# Altium schematic sheet attenuator.SchDoc
size 300 x 200 mm; SheetNumber: 1; SheetTotal: 1
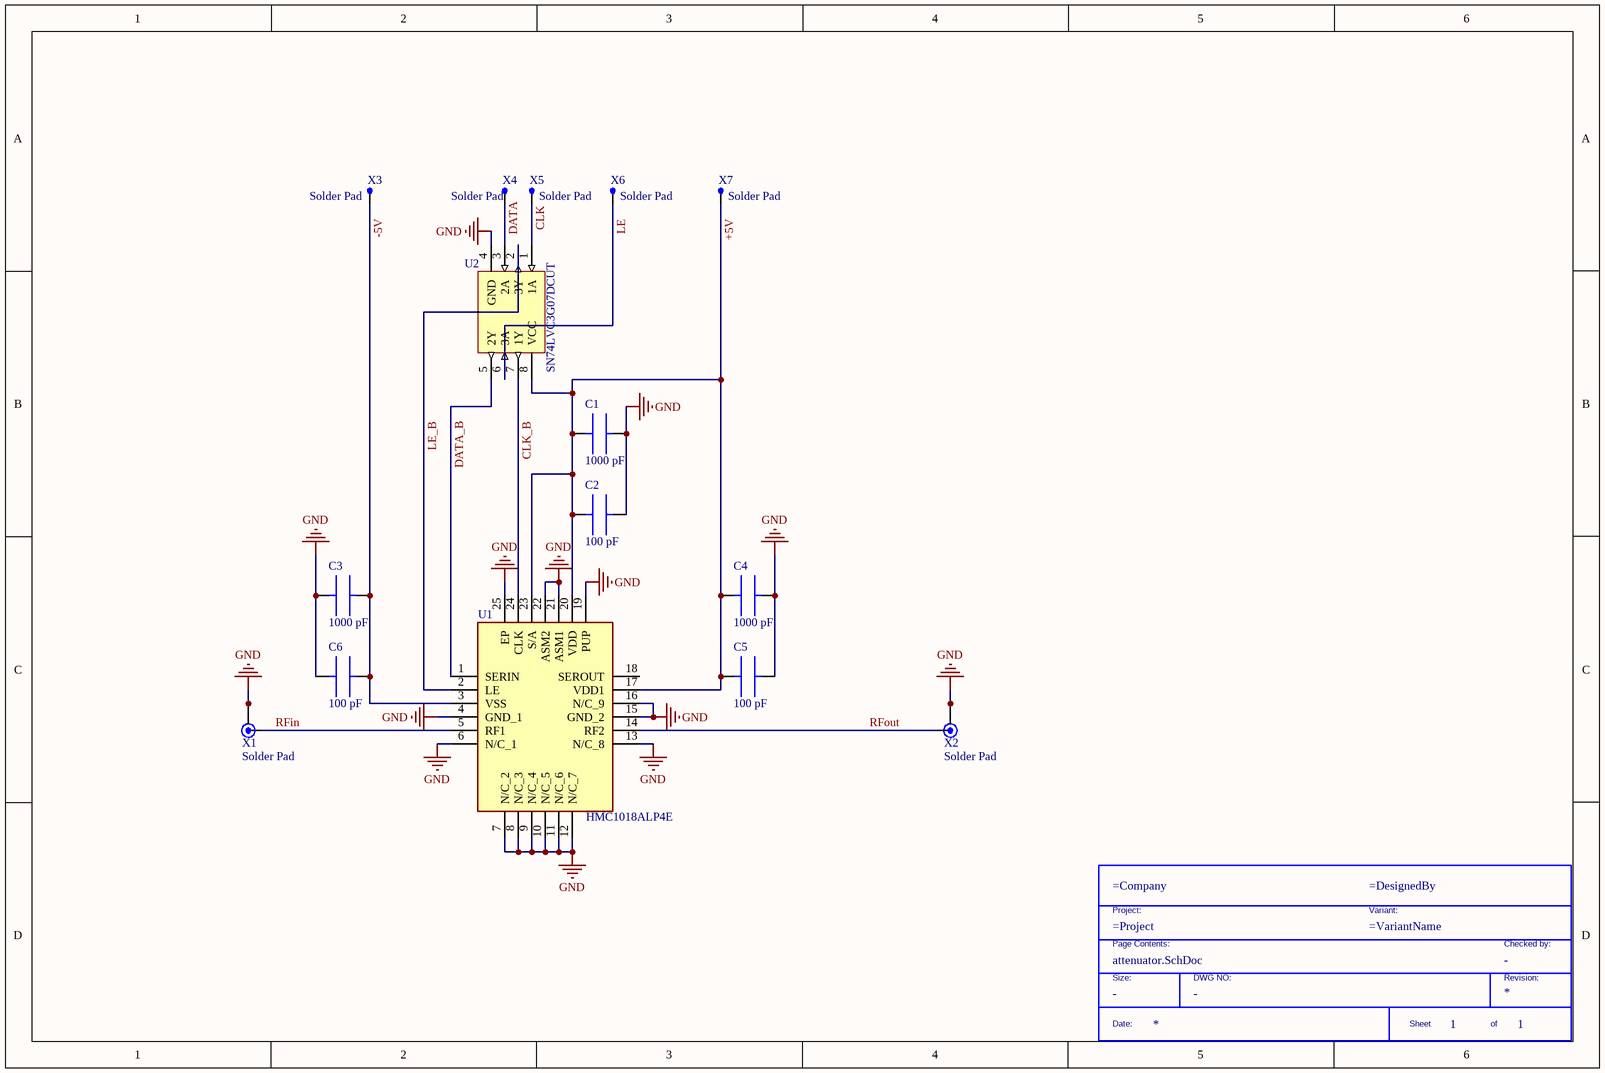
[diagram p0: attenuator.SchDoc]

## Parts
*  TitleBlock  (value not drawn)  (graphical)
C1  1000 pF  [C1000pF__C100nF]
C2  100 pF  [C100pF]
C3  1000 pF  [C1000pF__C100nF]
C4  1000 pF  [C1000pF__C100nF]
C5  100 pF  [C100pF]
C6  100 pF  [C100pF]
U1  HMC1018ALP4E  [Att_HMC101018ALPE]
U2  SN74LVC3G07DCUT  [Buf_SN74LVC3G07DCUT]
X1  Solder Pad  [CPW Edge Connector]
X2  Solder Pad  [CPW Edge Connector]
X3  Solder Pad  [Solder Pad]
X4  Solder Pad  [Solder Pad]
X5  Solder Pad  [Solder Pad]
X6  Solder Pad  [Solder Pad]
X7  Solder Pad  [Solder Pad]

## Nets
GND: C1.2 C2.2 C3.1 C4.2 C5.2 C6.1 U1.4(GND_1) U1.6(N/C_1) U1.7(N/C_2) U1.8(N/C_3) U1.9(N/C_4) U1.10(N/C_5) U1.11(N/C_6) U1.12(N/C_7) U1.13(N/C_8) U1.15(GND_2) U1.16(N/C_9) U1.19(PUP) U1.21(ASM1) U1.22(ASM2) U1.25(EP) U2.4(GND) X1.2 X1.3 X2.2 X2.3
+5V: C1.1 C2.1 C4.1 C5.1 U1.17(VDD1) U1.20(VDD) U1.23(S/A) U2.8(VCC) X7.1
-5V: C3.2 C6.2 U1.3(VSS) X3.1
CLK: U2.1(1A) X5.1
CLK_B: U1.24(CLK) U2.7(1Y)
DATA: U2.3(2A) X4.1
DATA_B: U1.1(SERIN) U2.5(2Y)
LE: U2.6(3A) X6.1
LE_B: U1.2(LE) U2.2(3Y)
RFin: U1.5(RF1) X1.1
RFout: U1.14(RF2) X2.1

Not connected (* = marked no-connect by the designer): U1 18(SEROUT)

## Notes on the sheet
- (in symbol TitleBlock) Project:; Variant:; Page Contents:; Checked by:; Size:; DWG NO:; Revision:; Date:; Sheet; of

## Library data of the parts
* = TitleBlock: Standard Title Block; DWG NO: -; Size: -; Checked by: -
C1 C3 C4 = C1000pF_GCM1885C1H102FA16D: Ceramic Capacitor, Multilayer, Ceramic, 50V, 1% +Tol, 1% -Tol, C0G, 30ppm/Cel TC, 0.001uF, Surface Mount, 0603; Manufacturer: Murata; Value: 1nF; Multilayer: Yes; Reference Standard: AEC-Q200; Supplier: Mouser; Supplier Part Number: 81-GCM1885C1H102FA6D; Manufacturer Part Number: GCM1885C1H102FA16D; RoHS: Yes; Category: Ceramic Capacitors; Stock: 27229; Pricing: 1=0.35, 10=0.229, 50=0.229, 100=0.138, 1000=0.092, 10000=0.074 (USD); Mounting Technology: Surface Mount; Pins: 2; Dielectric Material: Ceramic; Package Shape: Rectangular; Case/Package: 0603; Min Operating Temperature: -55°C; Max Operating Temperature: 125°C; Capacitor Type: Ceramic; Tolerance  (fill in as +-): 1%; Packaging: Tape and Reel; Tolerance (fill in as +-): 1%; Rated DC Voltage (URdc): 50V; Temperature Characteristics Code: C0G; Termination: Wraparound; Reach SVHC Compliant: Yes; RoHS Compliant: Yes; ComponentLink1URL: https://datasheet.ciiva.com:443/pdfs/VipMasterIC/IC/MURE/MURE-S-A0004370842/MURE-S-A0004372260-1.pdf?src-supplier=IHS+Markit; ComponentLink1Description: https://datasheet.ciiva.com:443/pdfs/VipMasterIC/IC/MURE/MURE-S-A0004370842/MURE-S-A0004372260-1.pdf?src-supplier=IHS+Markit
C2 C5 C6 = C100pF_GRM1555C2A101FA01D: Multilayer Ceramic Capacitors MLCC - SMD/SMT 100 pF 100 VDC 1% 0402 C0G (NP0); Manufacturer: Murata; Supplier: Mouser; Supplier Part Number: 81-GRM1555C2A11FA1D; Manufacturer Part Number: GRM1555C2A101FA01D; RoHS: No; Stock: 21646; Pricing: 1=0.18, 10=0.119, 50=0.119, 100=0.06, 1000=0.039, 10000=0.035 (USD)
U1 = Att_HMC1018ALP4E: Attenuators Attenuators; Manufacturer_Name: Analog Devices; Geometry.Height: 1mm; Mouser Part Number: 584-HMC1018ALP4E; Mouser Price/Stock: https://www.mouser.co.uk/ProductDetail/Analog-Devices/HMC1018ALP4E?qs=XflvcvBPbgW0VxFFfcxVBA%3D%3D; Manufacturer_Part_Number: HMC1018ALP4E; Datasheet Link: https://www.analog.com/media/en/technical-documentation/data-sheets/hmc1018a.pdf
U2 = Buf_SN74LVC3G07DCUT: Buffer, LVC/LCX/Z Series, 3-Func, 1-Input, CMOS, PDSO8; Manufacturer: Texas Instruments; Package Body Material: Plastic; Load Capacitance (CL): 50pF; Load/Preset Input: Yes; Max I(ol): 24mA; Channels: 3; Number of Inputs: 1; Output Characteristics: OPEN-DRAIN; Power Supplies: 3.3V; Prop. Delay@Nom-Sup: 3.7ns; Propagation Delay (tpd): 7.8ns; Schmitt Trigger: No; Max Supply Voltage: 5.5V; Min Supply Voltage: 1.65V; Nominal Supply Voltage: 1.8V; Qualification Status: Not Qualified; Supplier: Mouser; Supplier Part Number: 595-SN74LVC3G07DCUT; Manufacturer Part Number: SN74LVC3G07DCUT; RoHS: Yes; Category: Buffers, Drivers and Transceivers; Stock: 5143; Pricing: 1=1.13, 10=0.738, 50=0.738, 100=0.584, 1000=0.486, 10000=0.482 (USD); Case/Package: VSSOP; Pins: 8; Package Shape: Rectangular; Terminal Finish: Nickel; Min Operating Temperature: -40°C; Max Operating Temperature: 125°C; JESD-609 Code: e4; JESD-30 Code: R-PDSO-G8; Logic Type: BUFFER; Moisture Sensitivity Level: 1; Package Style: SMALL OUTLINE, VERY THIN PROFILE, SHRINK PITCHMeter; Packaging: Tape and Reel; Peak Reflow Temperature (Cel): 260°C; Surface Mount: Yes; Technology: CMOS; Terminal Form: Gull Wing; Terminal Position: DUAL; Length: 2.3mm; Width: 2mm; Height - Seated (Max): 0.9mm; Terminal Pitch: 0.5mm; Temperature Grade: AUTOMOTIVE; RoHS Compliant: Yes; Reach SVHC Compliant: Yes; ComponentLink1URL: https://www.ti.com:443/lit/ds/symlink/sn74lvc3g07.pdf?src-supplier=IHS+Markit; ComponentLink1Description: https://www.ti.com:443/lit/ds/symlink/sn74lvc3g07.pdf?src-supplier=IHS+Markit; ComponentLink2URL: https://datasheet.ciiva.com/22704/1831202-22704940.pdf?src-supplier=Element14; ComponentLink2Description: https://datasheet.ciiva.com/22704/1831202-22704940.pdf?src-supplier=Element14; ComponentLink3URL: https://datasheet.ciiva.com/15094/getdatasheetpartid-42252-15094217.pdf?src-supplier=Verical; ComponentLink3Description: https://datasheet.ciiva.com/15094/getdatasheetpartid-42252-15094217.pdf?src-supplier=Verical; ComponentLink4URL: https://datasheet.ciiva.com/41455/001017196-da-01-en-ic-b-dvr-trp-sn74lvc3g07dcut-vssop-8-tid-41455972.pdf?src-supplier=Conrad; ComponentLink4Description: https://datasheet.ciiva.com/41455/001017196-da-01-en-ic-b-dvr-trp-sn74lvc3g07dcut-vssop-8-tid-41455972.pdf?src-supplier=Conrad; ComponentLink5URL: https://datasheet.ciiva.com/7744/sn74lvc3g07-7744042.pdf?src-supplier=Element14; ComponentLink5Description: https://datasheet.ciiva.com/7744/sn74lvc3g07-7744042.pdf?src-supplier=Element14; ComponentLink6URL: https://datasheet.ciiva.com/6622/sn74lvc3g07-6622474.pdf?src-supplier=Digikey; ComponentLink6Description: https://datasheet.ciiva.com/6622/sn74lvc3g07-6622474.pdf?src-supplier=Digikey; ComponentLink7URL: https://datasheet.ciiva.com/6622/sn74lvc3g07-6622477.pdf?src-supplier=Digikey; ComponentLink7Description: https://datasheet.ciiva.com/6622/sn74lvc3g07-6622477.pdf?src-supplier=Digikey; ComponentLink8URL: https://datasheet.ciiva.com/6622/sn74lvc3g07-6622478.pdf?src-supplier=Digikey; ComponentLink8Description: https://datasheet.ciiva.com/6622/sn74lvc3g07-6622478.pdf?src-supplier=Digikey
X1 X2 = RF  CPW Solder Pad: Solder pad for RF Coplanar Waveguide Rogers 4350B Thickness 0.020" Copper 1oz
X3-X7 = Solder Pad: Pad to solder wires to